# EAGLE design Control Board (EAGLE 9.7.0)
Assembly variants: Production
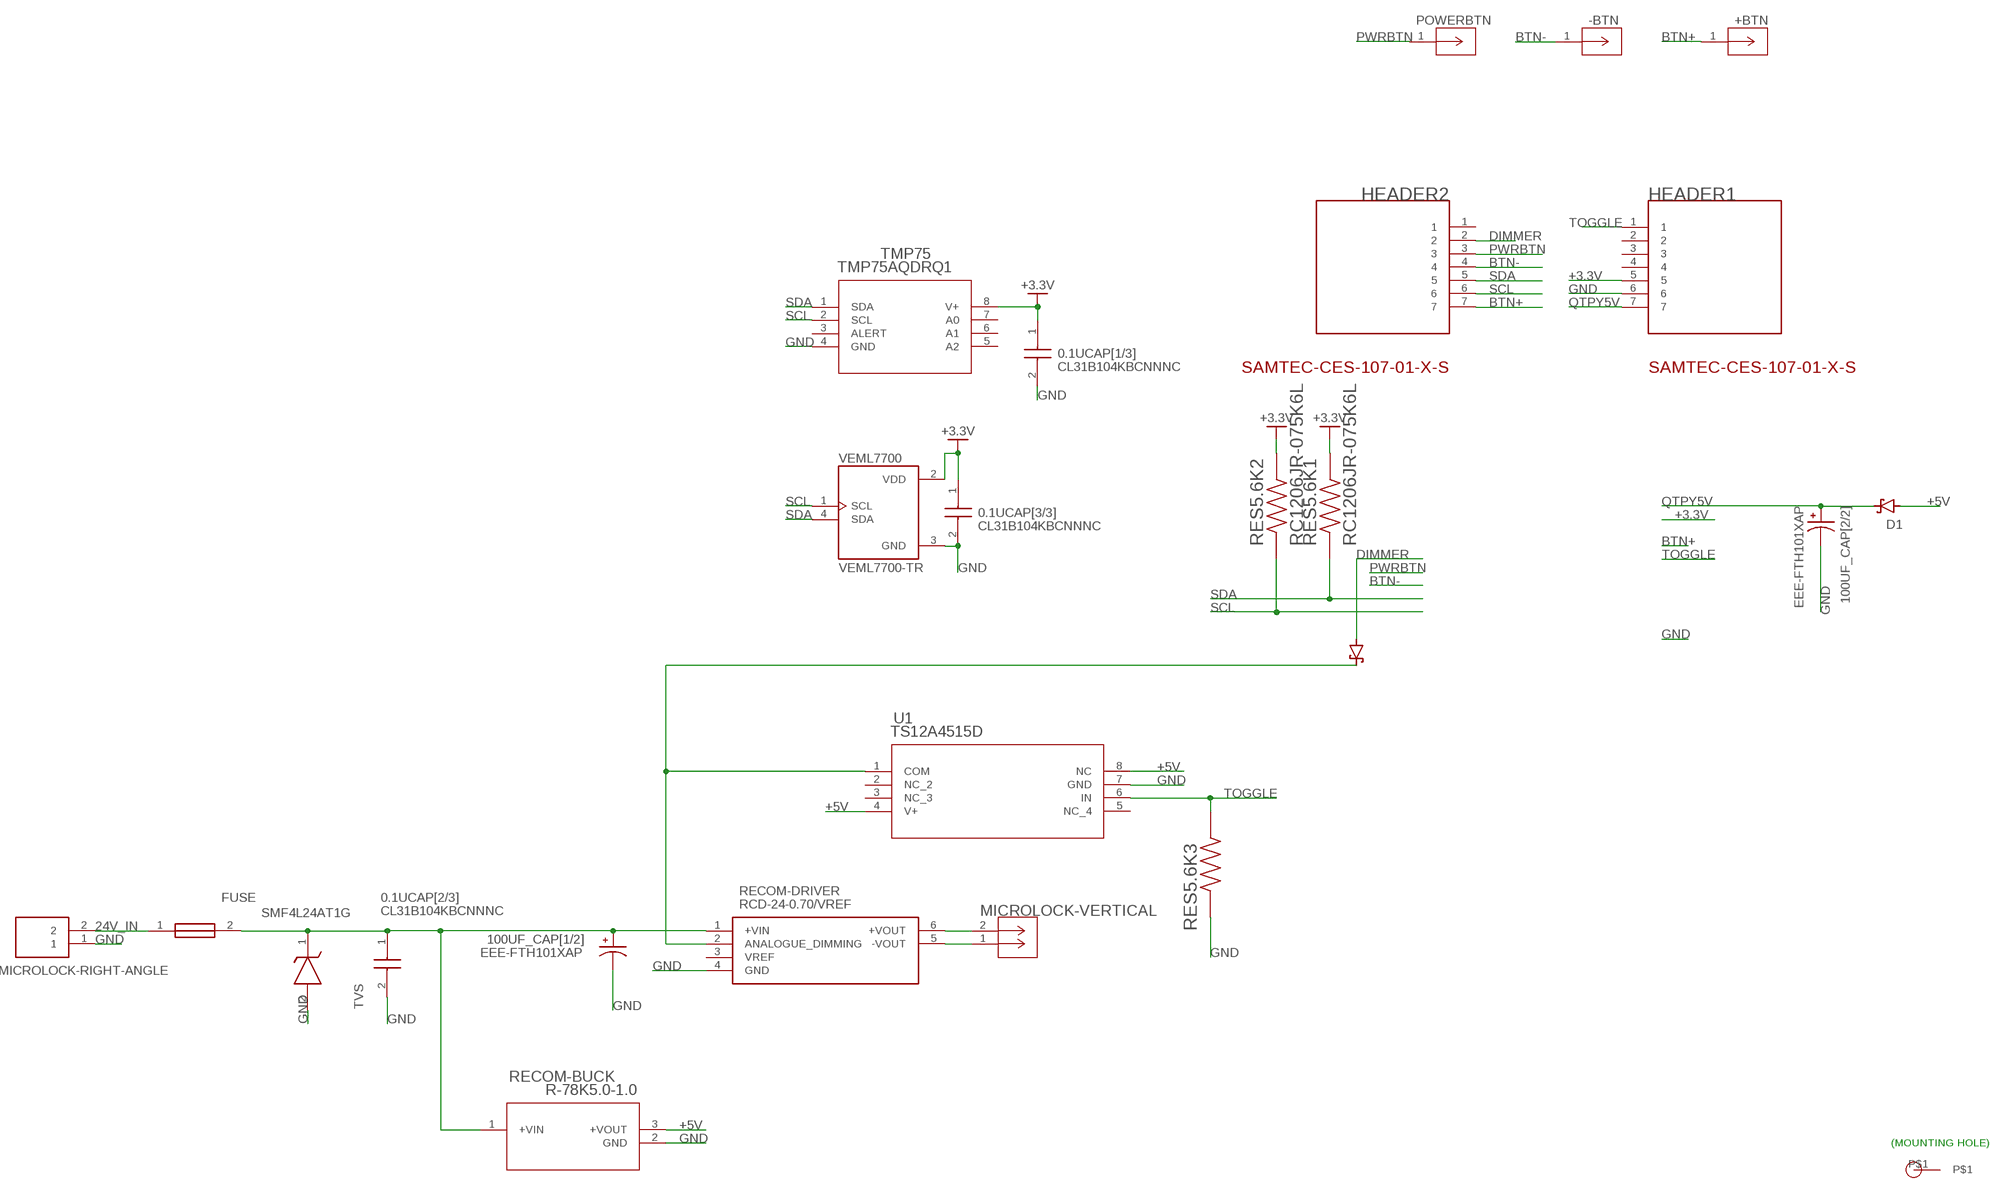
[diagram p0: schematic, sheet 1]

## Parts
0.1UCAP[1/3]  CL31B104KBCNNNC  [CAPC3216X100N]
0.1UCAP[2/3]  CL31B104KBCNNNC  [CAPC3216X100N]
0.1UCAP[3/3]  CL31B104KBCNNNC  [CAPC3216X100N]
100UF_CAP[1/2]  EEE-FTH101XAP  EEEFTH101XAP  [CAP_EEEFTH101XAP]
100UF_CAP[2/2]  EEE-FTH101XAP  EEEFTH101XAP  [CAP_EEEFTH101XAP]
+BTN  807-22-001-10-001101  807-22-001-10-001101CONN_807-22-001-10-001101_MIM  [CONN_807-22-001-10-001101_MIM]
-BTN  807-22-001-10-001101  807-22-001-10-001101CONN_807-22-001-10-001101_MIM  [CONN_807-22-001-10-001101_MIM]
D1  PMEG4010EGWX  [SOD-123]
D3  PMEG4010EGWX  [SOD-123]
FUSE  SMD2016B100TF/33  [SMD2016B100TF/33]
HEADER1  CES-107-01-G-S  SAMTEC-CES-107-01-X-SJ  [SAMTEC-CES-107-01-X-S]
HEADER2  CES-107-01-G-S  SAMTEC-CES-107-01-X-SJ  [SAMTEC-CES-107-01-X-S]
MICROLOCK-RIGHT-ANGLE  2200980271  220098-0271  [2200980271]
MICROLOCK-VERTICAL  2200970271  2200970271CONN_2200970000-SD_02_MOL  [CONN_2200970000-SD_02_MOL]
POWERBTN  807-22-001-10-001101  807-22-001-10-001101CONN_807-22-001-10-001101_MIM  [CONN_807-22-001-10-001101_MIM]
RECOM-BUCK  R-78K5.0-1.0  R-78K5.0-1.0SIP3_R-78K-0.5_RCP  [R-78K5.0-1.0_RCP]
RECOM-DRIVER  RCD-24-0.70/VREF  RCD-24-0.70_VREF  [RCD24030]
RES5.6K1  RC1206JR-075K6L  [RESC3116X65N]
RES5.6K2  RC1206JR-075K6L  [RESC3116X65N]
RES5.6K3  RC1206JR-075K6L  [RESC3116X65N]
TMP75  TMP75AQDRQ1  TMP75AQDRQ1D8_TEX  [D8_TEX]
TVS  SMF4L24AT1G  [SODFL3619X98N]
U1  TS12A4515D  TS12A4515DD8-L  [D8-L]
U$2  2.5MMPLATEDTHROUGHHOLE  [2.5MMPLATEDHOLE]  (not fitted in variant Production)
VEML7700  VEML7700-TR  [XDCR_VEML7700-TR]

## Nets
24V_IN: FUSE.1 MICROLOCK-RIGHT-ANGLE.2
+3.3V: 0.1UCAP[1/3].1 0.1UCAP[3/3].1 HEADER1.5 RES5.6K1.2 RES5.6K2.2 TMP75.8(V+) VEML7700.2(VDD)
+5V: D1.A RECOM-BUCK.3(+VOUT) U1.4(V+) U1.8(NC)
+24V: 0.1UCAP[2/3].1 100UF_CAP[1/2].1 FUSE.2 RECOM-BUCK.1(+VIN) RECOM-DRIVER.1(+VIN) TVS.1(K)
A0: D3.C RECOM-DRIVER.2(ANALOGUE_DIMMING) U1.1(COM)
BTN+: +BTN.1 HEADER2.7
BTN-: -BTN.1 HEADER2.4
DIMMER: D3.A HEADER2.2
GND: 0.1UCAP[1/3].2 0.1UCAP[2/3].2 0.1UCAP[3/3].2 100UF_CAP[1/2].2 100UF_CAP[2/2].2 HEADER1.6 MICROLOCK-RIGHT-ANGLE.1 RECOM-BUCK.2(GND) RECOM-DRIVER.4(GND) RES5.6K3.1 TMP75.4(GND) TVS.2(A) U1.7(GND) VEML7700.3(GND)
LED+: MICROLOCK-VERTICAL.2 RECOM-DRIVER.6(+VOUT)
LED-: MICROLOCK-VERTICAL.1 RECOM-DRIVER.5(-VOUT)
PWRBTN: HEADER2.3 POWERBTN.1
QTPY5V: 100UF_CAP[2/2].1 D1.C HEADER1.7
SCL: HEADER2.6 RES5.6K2.1 TMP75.2(SCL) VEML7700.1(SCL)
SDA: HEADER2.5 RES5.6K1.1 TMP75.1(SDA) VEML7700.4(SDA)
TOGGLE: HEADER1.1 RES5.6K3.2 U1.6(IN)
Unconnected: HEADER1.2 HEADER1.3 HEADER1.4 HEADER2.1 RECOM-DRIVER.3(VREF) TMP75.3(ALERT) TMP75.5(A2) TMP75.6(A1) TMP75.7(A0) U1.2(NC_2) U1.3(NC_3) U1.5(NC_4) U$2.P$1

## Notes on the sheet
- (MOUNTING HOLE)

## Library data of the parts
0.1UCAP[1/3] 0.1UCAP[2/3] 0.1UCAP[3/3] = CL31B104KBCNNNC:CL31B104KBCNNNC: CAP CER 0.1UF 50V X7R 1206; DATASHEET: https://product.samsungsem.com/mlcc/CL31B104KBCNNN.do; MANUFACTURER: Samsung Electro-Mechanics; MPN: CL31B104KBCNNNC
100UF_CAP[1/2] 100UF_CAP[2/2] = EEEFTH101XAP-snap:EEEFTH101XAP: CAP ALUM 100UF 20% 50V SMD; DATASHEET: https://industrial.panasonic.com/cdbs/www-data/pdf/RDE0000/RDE0000C1269.pdf; MANUFACTURER: Panasonic; MPN: EEE-FTH101XAP
+BTN -BTN POWERBTN = 807-22-001-10-001101:807-22-001-10-001101: CONTACT SPRING LOADED T/H GOLD; DATASHEET: https://www.mill-max.com/sites/default/files/external/catalog/2018-07/004-022.pdf; MANUFACTURER: Mill-Max; MPN: 807-22-001-10-001101
D1 D3 = Diodes:PMEG4010EGWX: DIODE SCHOTTKY 40V 1A SOD123; DATASHEET: https://assets.nexperia.com/documents/data-sheet/PMEG4010EGW.pdf; MANUFACTURER: Nexperia; MPN: PMEG4010EGWX
FUSE = SMD2016B100TF/33:SMD2016B100TF/33: PTC RESET FUSE 33V 1.1A 2016; DATASHEET: https://yageogroup.com/component-documentation/download/datasheet/SMD2016B100TF%2F33?lang=en; MANUFACTURER: YAGEO; MPN: SMD2016B100TF/33
HEADER1 HEADER2 = SAMTEC-CES-107-01-X-S:SAMTEC-CES-107-01-X-S: CONN RCPT 7POS 0.1 GOLD PCB; DATASHEET: https://suddendocs.samtec.com/catalog_english/ces.pdf; MANUFACTURER: Samtec; MPN: CES-107-01-G-S
MICROLOCK-RIGHT-ANGLE = molex-right-angle-220098-0271:220098-0271: 1.25WB MLP SGL RA TH ASSY 2CKT B; DATASHEET: https://www.molex.com/en-us/products/part-detail-pdf/2200980271?display=pdf; MANUFACTURER: Molex; MPN: 2200980271
MICROLOCK-VERTICAL = Molex MLP 2Pin Vertical:2200970271: 1.25WB MLP SGL VT TH ASSY 2CKT B; DATASHEET: https://www.molex.com/content/dam/molex/molex-dot-com/products/automated/en-us/salesdrawingpdf/220/220097/2200970271_sd.pdf; MANUFACTURER: Molex; MPN: 2200970271
RECOM-BUCK = R-78K5.0-1.0:R-78K5.0-1.0: 1A DC/DC-CONVERTER 'INNOLINE' SI; DATASHEET: https://recom-power.com/pdf/Innoline/R-78K-1.0.pdf; MANUFACTURER: RECOM Power; MPN: R-78K5.0-1.0
RECOM-DRIVER = [DRIVER]RCD-24-0.70_Vref:RCD-24-0.70_VREF: LED DRIVER CC BUCK 2-35V 700MA; DATASHEET: https://recom-power.com/pdf/Lightline_DC-DC/RCD-24.pdf; MANUFACTURER: RECOM Power; MPN: RCD-24-0.70/VREF
RES5.6K1-RES5.6K3 = RC1206JR-075K6L:RC1206JR-075K6L: RES 5.6K OHM 5% 1/4W 1206; DATASHEET: https://media.digikey.com/pdf/Data%20Sheets/Yageo%20PDFs/RC_Series_L_Suffix_Rev12_DS.pdf; MANUFACTURER: YAGEO; MPN: RC1206JR-075K6L
TMP75 = TMP75AQDRQ1:TMP75AQDRQ1: SENSOR DIGITAL -40C-125C 8SOIC; DATASHEET: https://www.ti.com/lit/ds/symlink/tmp75-q1.pdf; MANUFACTURER: Texas Instruments; MPN: TMP75AQDRQ1
TVS = SMF4L24AT1G:SMF4L24AT1G: TVS DIODE 24VWM 38.9VC SOD123F; DATASHEET: https://www.littelfuse.com/assetdocs/littelfuse_tvs_diode_smf4l_datasheet?assetguid=d2ba8fab-1de3-4176-8530-f36ecb0b8799; MANUFACTURER: Littelfuse; MPN: SMF4L24AT1G
U1 = TS12A4515D:TS12A4515D: IC SWITCH SPST-NCX1 10OHM 8SOIC; DATASHEET: https://www.ti.com/lit/ds/symlink/ts12a4515.pdf; MANUFACTURER: Texas Instruments; MPN: TS12A4515D
U$2 = 2.5mm-plated-through-hole:2.5MMPLATEDTHROUGHHOLE
VEML7700 = VEML7700-TR:VEML7700-TR: SENSOR OPT 545NM AMBIENT 4SMD; DATASHEET: https://www.vishay.com/docs/84286/veml7700.pdf; MANUFACTURER: Vishay; MPN: VEML7700-TR

## Board
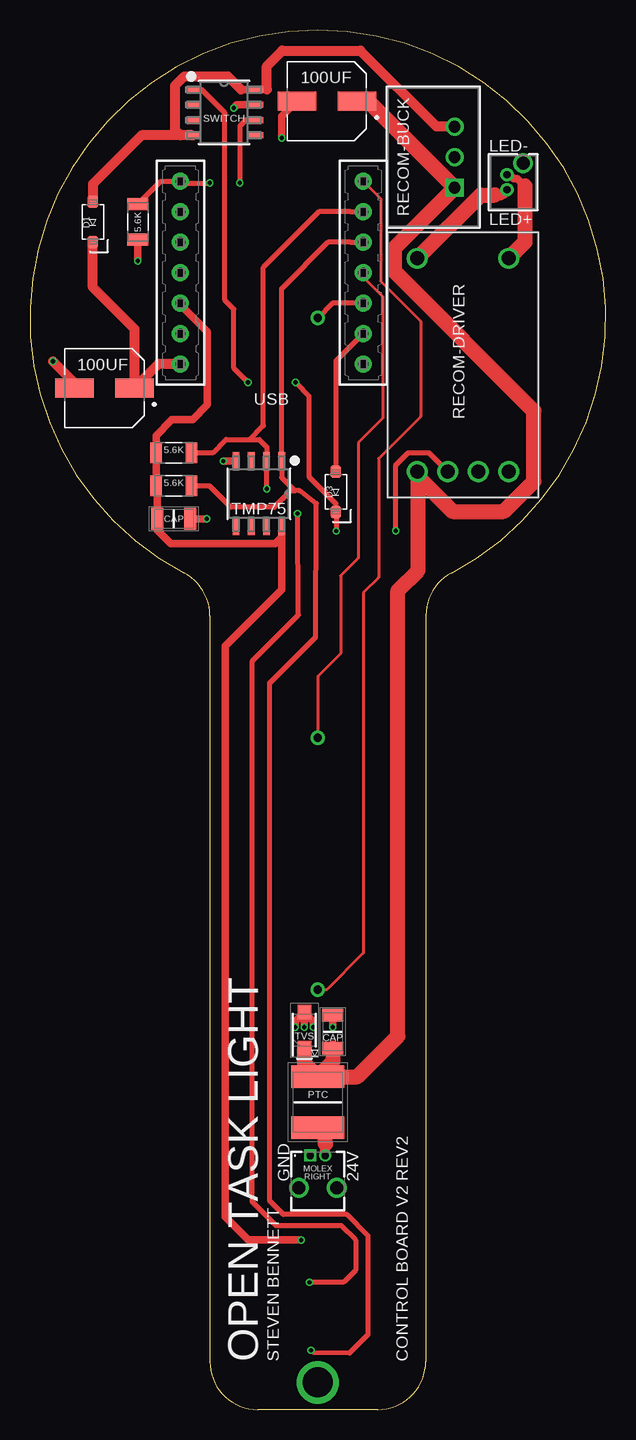
[diagram p1: board, top side]
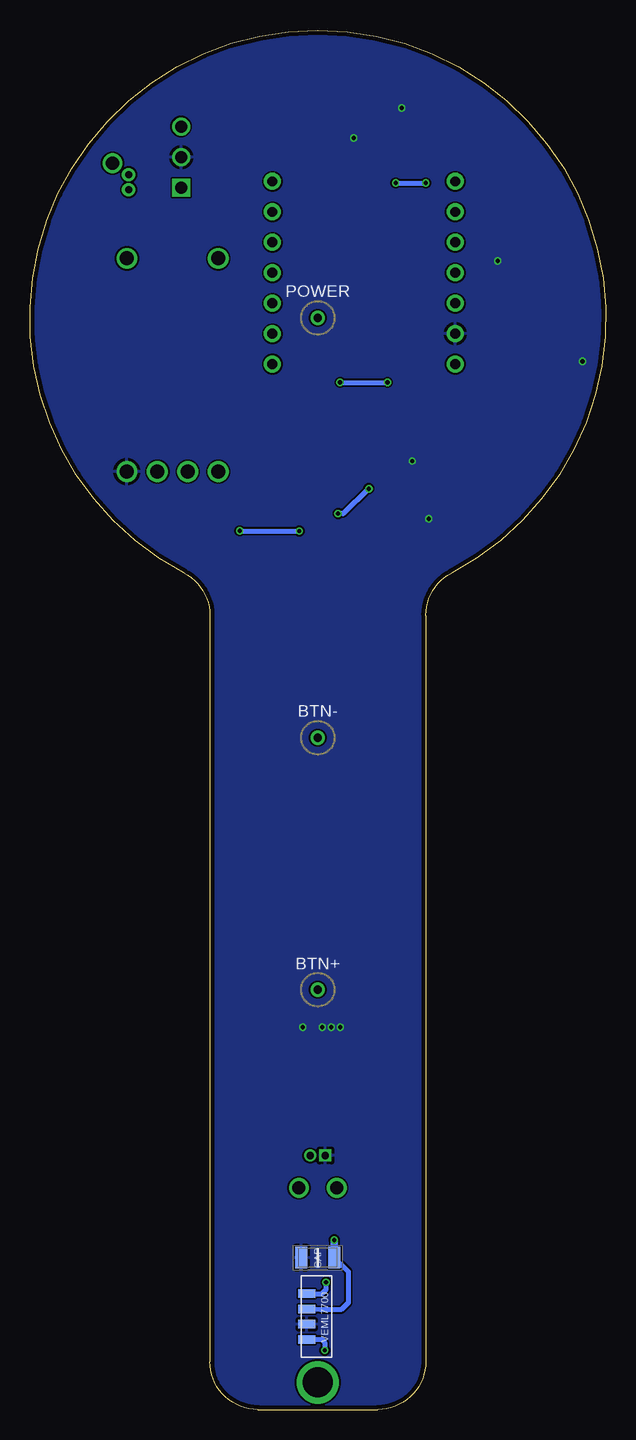
[diagram p2: board, bottom side, seen from below]

Size 47.97 x 115 mm. Coordinates in mm from the lower left corner, seen from the top.
Outline: 14.98,66.2 14.98,4 arc90 18.98,0 28.98,0 arc90 32.98,4 32.98,66.2 arc-62 35.13,69.74 arc305 12.84,69.74 arc-62 14.98,66.2
Copper layers (1*16): Top 0.035559375mm / dielectric 1.6mm / Bottom 0.035559375mm
Design rules "oshpark-2layer": minimum track width 6mil, minimum drill 10mil, track to track 6mil, track to pad 6mil, pad to pad 6mil, via to via 6mil, smd to smd 6mil, copper to edge 15mil, drill to drill 6mil, minimum pad ring 5mil, minimum via ring 5mil, stop-mask expansion 2.5mil, vias tented up to drill 0mil, thermal gap 10mil

### Footprints (pad centres in the part's own frame; a part is rotated, then mirrored left to right if it is on the bottom)
CAPC3216X100N = smd 1.02 x 1.78: 1 -1.38,0; 2 1.38,0
CAP_EEEFTH101XAP = smd 3.2 x 1.6: 1 -2.5,0; 2 2.5,0
CONN_807-22-001-10-001101_MIM = drill 0.686 pad 1.194: 1 0,0
SOD-123 = smd 1.02 x 0.86: A 1.68,0; C -1.68,0
SMD2016B100TF/33 = smd 1.9 x 4.44: 1 -2.125,0; 2 2.125,0
SAMTEC-CES-107-01-X-S = drill 0.81 pad 1.41: 1 -7.62,0; 2 -5.08,0; 3 -2.54,0; 4 0,0; 5 2.54,0; 6 5.08,0; 7 7.62,0
2200980271 = drill 0.6 pad 1 square: 1 -0.625,2.8 | drill 0.6 pad 1: 2 0.625,2.8 | drill 1.092 pad 1.092: 3 1.575,0.1; 4 -1.575,0.1
CONN_2200970000-SD_02_MOL = drill 0.61 pad 1.118: 1 0,0; 2 1.25,0 | drill 1.092 pad 1.092: 3 -0.95,1.35
R-78K5.0-1.0_RCP = drill 0.991 pad 1.499 square: 1 0,0 | drill 0.991 pad 1.499: 2 2.54,0; 3 5.08,0
RCD24030 = drill 1.15 pad 1.725: 1 0,0; 2 0,-2.54; 3 0,-5.08; 4 0,-7.62; 5 17.78,-7.62; 6 17.78,0
RESC3116X65N = smd 0.97 x 1.73: 1 -1.48,0; 2 1.48,0
D8_TEX = smd 1.46 x 0.559: 1 -2.724,1.905; 2 -2.724,0.635; 3 -2.724,-0.635; 4 -2.724,-1.905; 5 2.724,-1.905; 6 2.724,-0.635; 7 2.724,0.635; 8 2.724,1.905
SODFL3619X98N = smd 1.22 x 1.12: 1 -1.5,0; 2 1.5,0
D8-L = smd 1.257 x 0.508: 1 -2.623,1.905; 2 -2.623,0.635; 3 -2.623,-0.635; 4 -2.623,-1.905; 5 2.623,-1.905; 6 2.623,-0.635; 7 2.623,0.635; 8 2.623,1.905
2.5MMPLATEDHOLE = drill 2.5 pad 2.8: P$1 0,0
XDCR_VEML7700-TR = smd 1.4 x 0.7: 1 -0.425,1.905; 2 -0.425,0.635; 3 -0.425,-0.635; 4 -0.425,-1.905

### Placement (x,y rotation side)
0.1UCAP[1/3]  11.98,74.25 0 top
0.1UCAP[2/3]  25.23,31.5 90 top
0.1UCAP[3/3]  23.99,12.66 180 bottom
100UF_CAP[1/2]  24.73,109.06 180 top
100UF_CAP[2/2]  6.2,85.15 180 top
+BTN  23.98,35 0 bottom
-BTN  23.98,56 0 bottom
D1  5.23,99 90 top
D3  25.48,76.5 90 top
FUSE  23.98,25.62 90 top
HEADER1  12.53,94.76 270 top
HEADER2  27.77,94.76 90 top
MICROLOCK-RIGHT-ANGLE  23.98,18.38 0 top
MICROLOCK-VERTICAL  39.74,102.94 270 top
POWERBTN  23.98,91 0 bottom
RECOM-BUCK  35.38,101.86 90 top
RECOM-DRIVER  32.28,78.19 90 top
RES5.6K1  11.98,77 180 top
RES5.6K2  11.98,79.75 180 top
RES5.6K3  8.98,99 90 top
TMP75  19.07,76.34 270 top
TVS  22.86,31.62 90 top
U1  16.17,108.12 0 top
U$2  23.98,2.26 0 top
VEML7700  24.48,7.75 0 bottom

### Tracks (layer width: path | path; a pad name or v marks a point on that pad's centre or on a via)
24V_IN
  Top 0.813: MICROLOCK-RIGHT-ANGLE.2 24.61,22.12
  Top 1.27: 24.61,22.12 24.61,23.5
+3.3V  (via drill 0.35)
  Top 0.4: 10.57,77.06 RES5.6K1.2
  Top 0.61: HEADER1.5 12.53,92.1 14.78,89.85 14.78,83.75 13.55,82.52 11.83,82.52 10.5,81.19 RES5.6K2.2 RES5.6K1.2 | 20.97,68.36 16.28,63.66 16.28,16.05 18.2,14.13 v22.6,14.13 | 10.57,77.06 10.6,77.03 0.1UCAP[1/3].1 10.6,73.31 11.73,72.18 20.42,72.18 20.97,72.73 TMP75.8 20.97,68.36 | 20.97,68.36
  Bottom 0.4: VEML7700.2 23.75,8.32 22.03,8.32 21.44,8.91 21.44,11.5 0.1UCAP[3/3].1
  Bottom 0.61: v22.6,14.13 0.1UCAP[3/3].1
+5V
  Top 0.61: 19.73,110.03 U1.8 17.59,110.03
  Top 0.813: RECOM-BUCK.3 33.88,106.94 27.54,113.28 21.02,113.28 19.73,112 19.73,110.03 | D1.A 5.23,102.15 9.3,106.22 12.55,106.22 | U1.4 12.55,106.22 | 12.55,106.22 12.11,106.66 12.11,110.4 12.85,111.14 16.48,111.14 17.59,110.03
+24V
  Top 1.27: FUSE.2 22.86,28.88 TVS.1 | 0.1UCAP[2/3].1 25.23,29 FUSE.2 | FUSE.2 27.29,27.75 30.66,31.12 30.66,68.27 32.34,69.95 32.34,78.12 RECOM-DRIVER.1 32.28,77.81 35.21,74.88 39.48,74.88 41.98,77.38 41.98,83.25 30.38,94.86 30.38,96.86 RECOM-BUCK.1 28.18,109.06 100UF_CAP[1/2].1
A0  (via drill 0.35)
  Top 0.4: RECOM-DRIVER.2 33.25,79.75 31.48,79.75 30.48,78.75 v30.48,73.25 | v22.13,85.62 22.13,85.61 23.23,84.5 23.23,77.77 25.48,75.52 D3.C 25.53,74.78 v25.53,73.24 | v18.17,85.62 16.98,86.81 16.98,91.75 16.23,92.5 16.23,108.09 14.3,110.03 U1.1
  Bottom 0.4: v30.48,73.25 v30.47,73.24 v25.53,73.24 | v22.13,85.62 v18.17,85.62
BTN+
  Top 0.254: HEADER2.7 28.32,101.84 29.21,100.94 29.21,94.07 32.56,90.72 32.56,82.78 29.06,79.28 29.06,69.37 27.78,68.1 27.78,38.05 24.73,35 +BTN.1
BTN-
  Top 0.254: -BTN.1 23.98,61.12 25.88,63.02 25.88,69.52 27.36,71 27.36,80.6 29.39,82.63 29.39,92.77 27.77,94.39 HEADER2.4
DIMMER
  Top 0.4: HEADER2.2 25.48,87.4 D3.A
GND  (via drill 0.35)
  Top 0.61: RES5.6K3.1 v8.98,95.75 | TMP75.4 v16.11,79.06 | 0.1UCAP[1/3].2 v14.73,74.25 | TVS.2 22.11,32.38 v22.11,31.88 | TVS.2 23.61,32.38 v23.61,31.88 | 0.1UCAP[2/3].2 v25.23,31.88 | TVS.2 v22.86,31.88 | 100UF_CAP[1/2].2 20.98,107.81 v20.98,106 | v16.98,108.5 17.24,108.76 U1.7
  Top 0.813: v1.92,87.38 3.7,85.59 100UF_CAP[2/2].2
  pour Bottom: -9.19,-2.92 58.16,-2.92 58.16,120.42 -9.19,120.42
LED+
  Top 0.813: MICROLOCK-VERTICAL.2 39.3,101.25 38.73,101.25
  Top 1.27: 38.73,101.25 37.56,101.25 RECOM-DRIVER.6
LED-
  Top 0.61: MICROLOCK-VERTICAL.1 39.99,102.94 40.32,102.61 40.62,102.61 41.23,102
  Top 1.27: 41.23,102 41.23,97.31 RECOM-DRIVER.5
PWRBTN
  Top 0.4: HEADER2.3 25.21,92.22 POWERBTN.1
QTPY5V
  Top 0.813: D1.C 5.23,93.56 8.7,90.09 100UF_CAP[2/2].1 10.7,87.14 HEADER1.7
SCL  (via drill 0.35)
  Top 0.4: 26.73,99.84 24.08,99.84 19.45,95.22 19.45,82.01 18.3,80.86 | v23.29,10.61 26.13,10.61 27.13,11.62 27.13,14.13 25.94,15.32 20.51,15.32 18.54,17.3 18.54,62.39 22.37,66.23 v22.3,74.69 | RES5.6K2.1 15.22,79.75 16.33,80.86 18.3,80.86 | TMP75.2 19.7,76.8 19.73,76.77 v19.73,76.76 | 18.3,80.86 19.12,80.86 19.73,80.25 19.73,79.1 | 26.73,99.84 | 26.73,99.84 HEADER2.6
  Top 0.508: 19.73,79.1 TMP75.2
  Bottom 0.4: v22.3,74.69 21.88,74.69 v19.73,76.76 | VEML7700.1 23.66,9.66 23.29,10.02 v23.29,10.61
SDA  (via drill 0.35)
  Top 0.4: v23.41,4.94 23.49,4.94 23.67,4.75 26.62,4.7 28.19,6.26 28.19,14.48 26.42,16.25 21.11,16.25 19.96,17.4 19.96,60.55 23.8,64.38 23.86,75.53 22.47,76.59 22.07,76.59 | 26.73,97.3 24.82,97.3 20.97,93.46 TMP75.1 20.97,77.69 22.07,76.59 | RES5.6K1.1 14.96,77 16.74,75.23 20.37,75.23 21.74,76.59 22.07,76.59 | 26.73,97.3 | 26.73,97.3 HEADER2.5
  Bottom 0.4: VEML7700.4 23.66,5.84 23.41,5.6 v23.41,4.94
TOGGLE  (via drill 0.35)
  Top 0.4: v14.98,102.25 12.67,102.25 HEADER1.1 10.89,102.38 RES5.6K3.2 | U1.6 17.97,107.49 17.48,107 v17.48,102.25
  Bottom 0.4: v17.48,102.25 v14.98,102.25

### Text on the board
tPlace: LED- | LED+ | USB | GND | 24V
tNames: 100UF | SWITCH | 5.6K | 100UF | 5.6K | 5.6K | CAP | TVS | CAP | PTC | MOLEX / RIGHT | OPEN TASK LIGHT | STEVEN BENNETT | CONTROL BOARD V2 REV2
bNames: POWER | BTN- | BTN+ | CAP
PrivateNotes: DAB19922024 | SERIAL NO.